# Altium schematic sheet OPEN_DRAIN_Sheet1.SchDoc
size A4; SheetNumber: 9; SheetTotal: 9
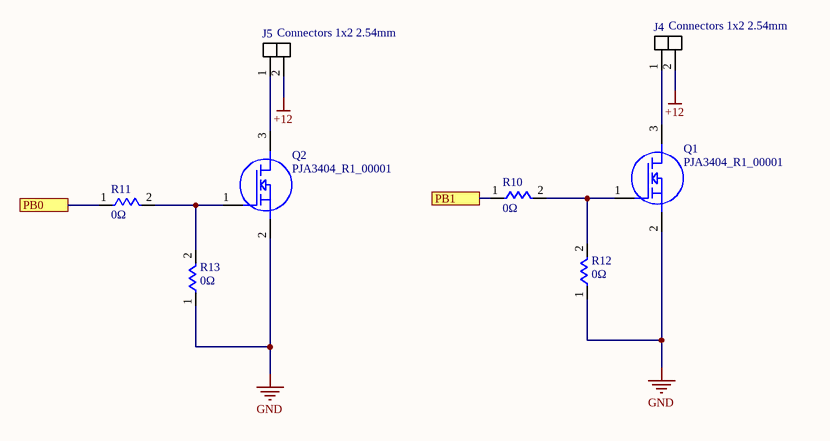
[diagram p0: OPEN_DRAIN_Sheet1.SchDoc]

## Parts
J4  Connectors 1x2 2.54mm  [Connectors 1x2 2.54mm]
J5  Connectors 1x2 2.54mm  [Connectors 1x2 2.54mm]
Q1  PJA3404_R1_00001  [SOT95P240X110-3N]
Q2  PJA3404_R1_00001  [SOT95P240X110-3N]
R10  0Ω  [RES - 0603]
R11  0Ω  [RES - 0603]
R12  0Ω  [RES - 0603]
R13  0Ω  [RES - 0603]

## Ports
PB0, PB1

## Nets
+12: J4.2 J5.2
GND: Q1.2 Q2.2 R12.1 R13.1
PB0: R11.1 ; port PB0
PB1: R10.1 ; port PB1
NetJ4_1: J4.1 Q1.3
NetJ5_1: J5.1 Q2.3
NetQ1_1: Q1.1 R10.2 R12.2
NetQ2_1: Q2.1 R11.2 R13.2

## Library data of the parts
J4 J5 = Connectors 1x2 2.54mm: 2 Pin (1x2) 2.54mm Erkek Pin Header THT; ComponentLink1Description: Satın Alma Linki; ComponentLink1URL: https://www.direnc.net/2-pin-1x2-254mm-erkek-pin-header-tht; ComponentLink2Description: Datasheet; ComponentLink2URL: https://pdf.direnc.net/upload/2-pin-1x2-254mm-erkek-pin-header-tht-datasheet.pdf
Q1 Q2 = Mosfet: PJA3404_R1_00001 - MOSFET DIS.5.6A 30V N-CH SOT23 ENHANCEMENT SMT; ComponentLink1Description: Satın Alma Linki; ComponentLink1URL: https://www.ozdisan.com/guc-yari-iletkenleri/mosfetler/mosfet-discrete/PJA3404R100001; ComponentLink2Description: Datasheet; ComponentLink2URL: https://cdn.ozdisan.com/ETicaret_Dosya/462895_6521209.pdf
R10-R13 = Res: SMD Res; ComponentLink1Description: Datasheet; ComponentLink1URL: https://cdn.ozdisan.com/ETicaret_Dosya/570122_9878629.pdf; ComponentLink2Description: Satın Alma Linki; ComponentLink2URL: https://www.ozdisan.com/pasif-komponentler/direncler/smt-smd-direncler/TC0325B3301T5C; ComponentLink3Description: Satın Alma Linki; ComponentLink3URL: https://ozdisan.com/pasif-komponentler/direncler/smt-smd-ve-cip-direncler/0603SAF4701T5E; ComponentLink4Description: Satın Alma Linki; ComponentLink4URL: https://ozdisan.com/pasif-komponentler/direncler/smt-smd-ve-cip-direncler/0805S8F604JT5E; ComponentLink5Description: Satın Alma Linki; ComponentLink5URL: https://ozdisan.com/pasif-komponentler/direncler/smt-smd-ve-cip-direncler/0603SAF1022T5E; ComponentLink6Description: Satın Alma Linki; ComponentLink6URL: https://www.ozdisan.com/pasif-komponentler/direncler/smt-smd-direncler/CQ03SAF0000T5E